# Altium schematic sheet Headers.SchDoc: Headers
size Letter; Date: 1/14/2018; Author: Logan Horowitz; DocumentNumber: 6; Revision: 1.1; SheetNumber: 6; DocumentName: Headers
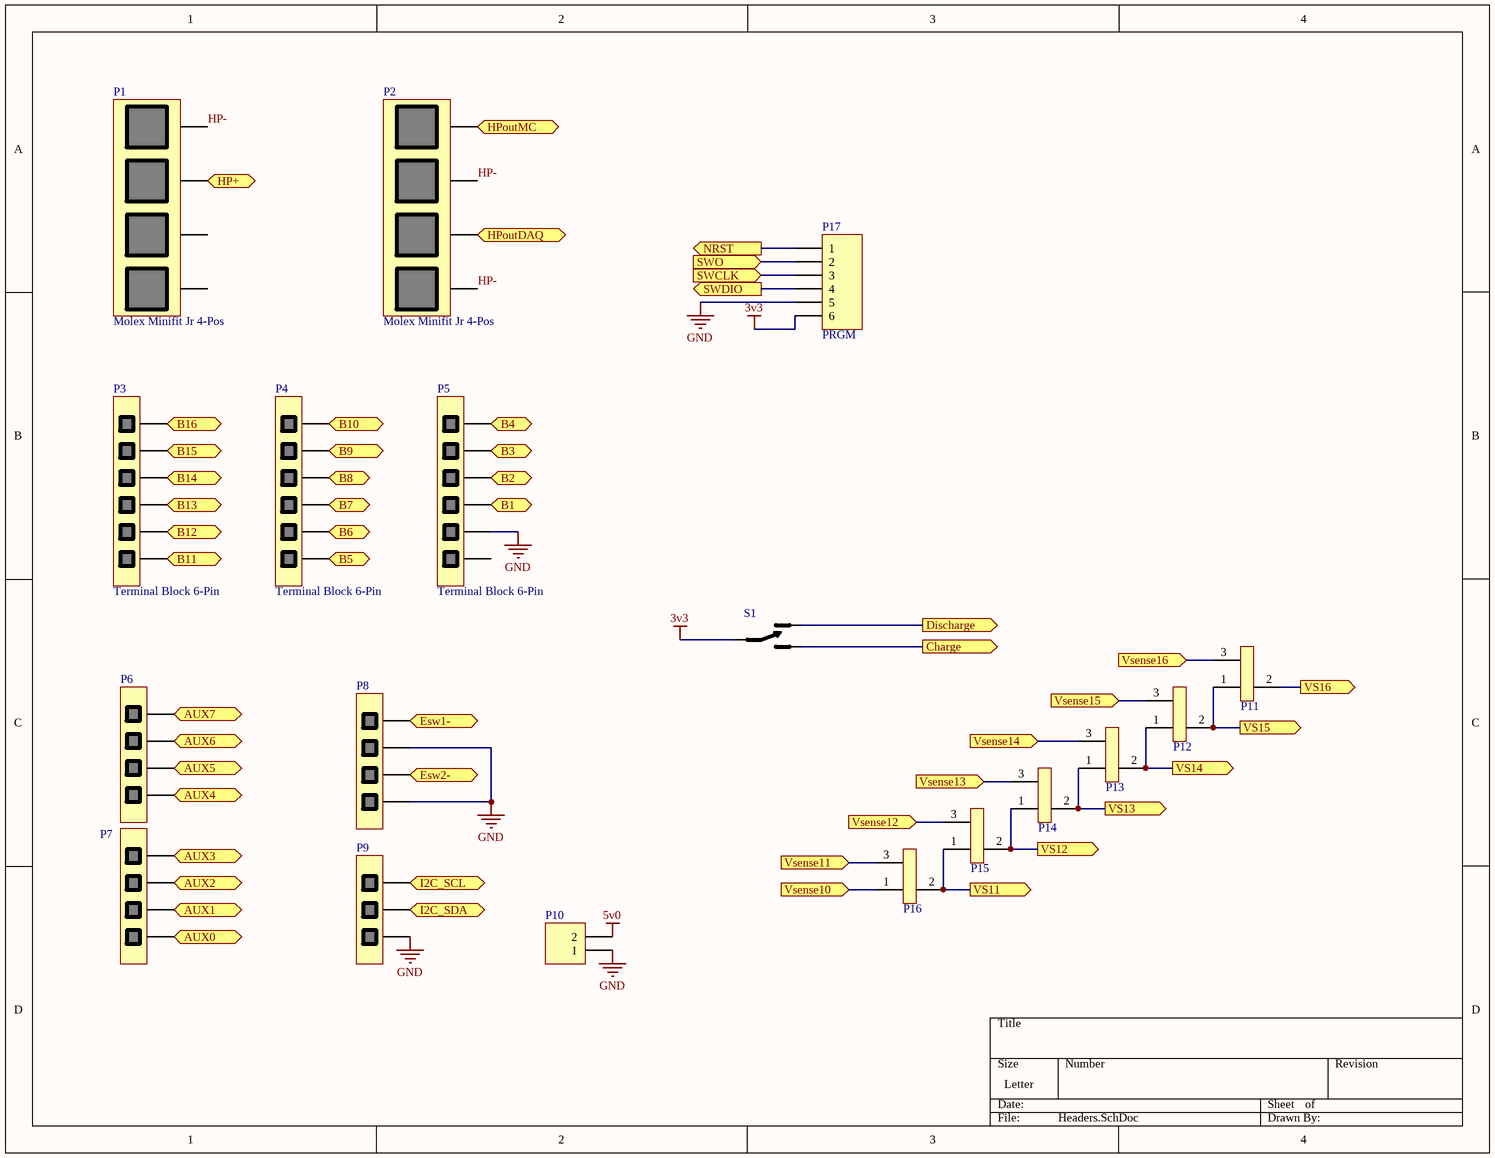
[diagram p0: Headers.SchDoc]

## Parts
P1  Molex Minifit Jr 4-Pos  [MINIFITJR 2X2]
P2  Molex Minifit Jr 4-Pos  [MINIFITJR 2X2]
P3  Terminal Block 6-Pin  [PTSM 6-Pos]
P4  Terminal Block 6-Pin  [PTSM 6-Pos]
P5  Terminal Block 6-Pin  [PTSM 6-Pos]
P6  Terminal Block 4-Pos  [PTSM 4-Pos]  (value not drawn)
P7  Terminal Block 4-Pos  [PTSM 4-Pos]  (value not drawn)
P8  Terminal Block 4-Pos  [PTSM 4-Pos]  (value not drawn)
P9  Terminal Block 3-Pos  [PTSM 3-Pos]  (value not drawn)
P10  Header  [Header 2x1]  (value not drawn)
P11  Header 3_1  [HEADER 3X1]  (value not drawn)
P12  Header 3_1  [HEADER 3X1]  (value not drawn)
P13  Header 3_1  [HEADER 3X1]  (value not drawn)
P14  Header 3_1  [HEADER 3X1]  (value not drawn)
P15  Header 3_1  [HEADER 3X1]  (value not drawn)
P16  Header 3_1  [HEADER 3X1]  (value not drawn)
P17  PRGM  [HEADER 6X1]
S1  Switch  [Switch]  (value not drawn)

## Ports
AUX0 (out), AUX1 (out), AUX2 (out), AUX3 (out), AUX4 (out), AUX5 (out), AUX6 (out), AUX7 (out), B1 (out), B2 (out), B3 (out), B4 (out), B5 (out), B6 (out), B7 (out), B8 (out), B9 (out), B10 (out), B11 (out), B12 (out), B13 (out), B14 (out), B15 (out), B16 (bidir), Charge (out), Discharge (out), Esw1- (out), Esw2- (out), HP+ (out), HPoutDAQ (in), HPoutMC (in), I2C_SCL (bidir), I2C_SDA (bidir), NRST (out), SWCLK (in), SWDIO (out), SWO (in), VS11 (out), VS12 (out), VS13 (out), VS14 (out), VS15 (out), VS16 (out), Vsense10 (in), Vsense11 (in), Vsense12 (in), Vsense13 (in), Vsense14 (in), Vsense15 (in), Vsense16 (in)

## Nets
3v3: P17.6 S1.2
5v0: P10.2
GND: P5.5 P8.2 P8.4 P9.3 P10.1 P17.5
AUX0: P7.4 ; port AUX0
AUX1: P7.3 ; port AUX1
AUX2: P7.2 ; port AUX2
AUX3: P7.1 ; port AUX3
AUX4: P6.4 ; port AUX4
AUX5: P6.3 ; port AUX5
AUX6: P6.2 ; port AUX6
AUX7: P6.1 ; port AUX7
B1: P5.4 ; port B1
B2: P5.3 ; port B2
B3: P5.2 ; port B3
B4: P5.1 ; port B4
B5: P4.6 ; port B5
B6: P4.5 ; port B6
B7: P4.4 ; port B7
B8: P4.3 ; port B8
B9: P4.2 ; port B9
B10: P4.1 ; port B10
B11: P3.6 ; port B11
B12: P3.5 ; port B12
B13: P3.4 ; port B13
B14: P3.3 ; port B14
B15: P3.2 ; port B15
B16: P3.1 ; port B16
Charge: S1.1 ; port Charge
Discharge: S1.3 ; port Discharge
Esw1-: P8.1 ; port Esw1-
Esw2-: P8.3 ; port Esw2-
HP+: P1.2 ; port HP+
HP-: P1.1 P2.2 P2.4
HPoutDAQ: P2.3 ; port HPoutDAQ
HPoutMC: P2.1 ; port HPoutMC
I2C_SCL: P9.1 ; port I2C_SCL
I2C_SDA: P9.2 ; port I2C_SDA
NRST: P17.1 ; port NRST
SWCLK: P17.3 ; port SWCLK
SWDIO: P17.4 ; port SWDIO
SWO: P17.2 ; port SWO
VS11: P15.1 P16.2 ; port VS11
VS12: P14.1 P15.2 ; port VS12
VS13: P13.1 P14.2 ; port VS13
VS14: P12.1 P13.2 ; port VS14
VS15: P11.1 P12.2 ; port VS15
VS16: P11.2 ; port VS16
Vsense10: P16.1 ; port Vsense10
Vsense11: P16.3 ; port Vsense11
Vsense12: P15.3 ; port Vsense12
Vsense13: P14.3 ; port Vsense13
Vsense14: P13.3 ; port Vsense14
Vsense15: P12.3 ; port Vsense15
Vsense16: P11.3 ; port Vsense16

Not connected (* = marked no-connect by the designer): P1 3 4; P5 6

## Library data of the parts
P10 = Header 2x1: Header, 2-Pin
P17 = Header 6x1: Header, 5-Pin